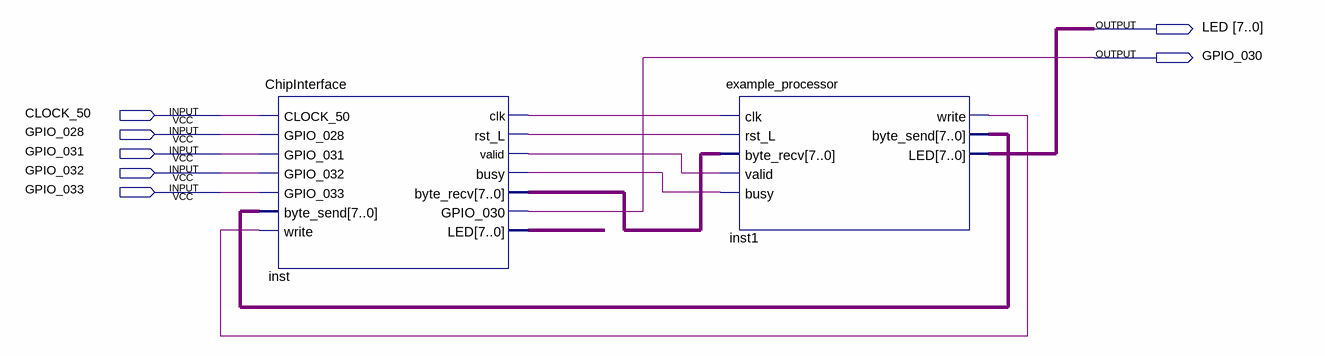
[diagram p0: schematic sheet]
// Quartus schematic example_diagram.bdf as structural Verilog: 2 symbols, 7 pins
module example_diagram (
  input  CLOCK_50,
  input  GPIO_028,
  input  GPIO_031,
  input  GPIO_032,
  input  GPIO_033,
  output [7:0] LED,
  output GPIO_030
);

  wire inst1_write, inst_busy, inst_clk, inst_rst_l, inst_valid;
  wire [7:0] inst1_byte_send, inst_byte_recv, inst_led;

  ChipInterface inst (
    .CLOCK_50(CLOCK_50), .GPIO_028(GPIO_028), .GPIO_031(GPIO_031), .GPIO_032(GPIO_032), .GPIO_033(GPIO_033),
    .byte_send(inst1_byte_send), .write(inst1_write), .clk(inst_clk), .rst_L(inst_rst_l), .valid(inst_valid),
    .busy(inst_busy), .byte_recv(inst_byte_recv), .GPIO_030(GPIO_030), .LED(inst_led));
  example_processor inst1 (
    .clk(inst_clk), .rst_L(inst_rst_l), .byte_recv(inst_byte_recv), .valid(inst_valid), .busy(inst_busy),
    .write(inst1_write), .byte_send(inst1_byte_send), .LED(LED));
endmodule
